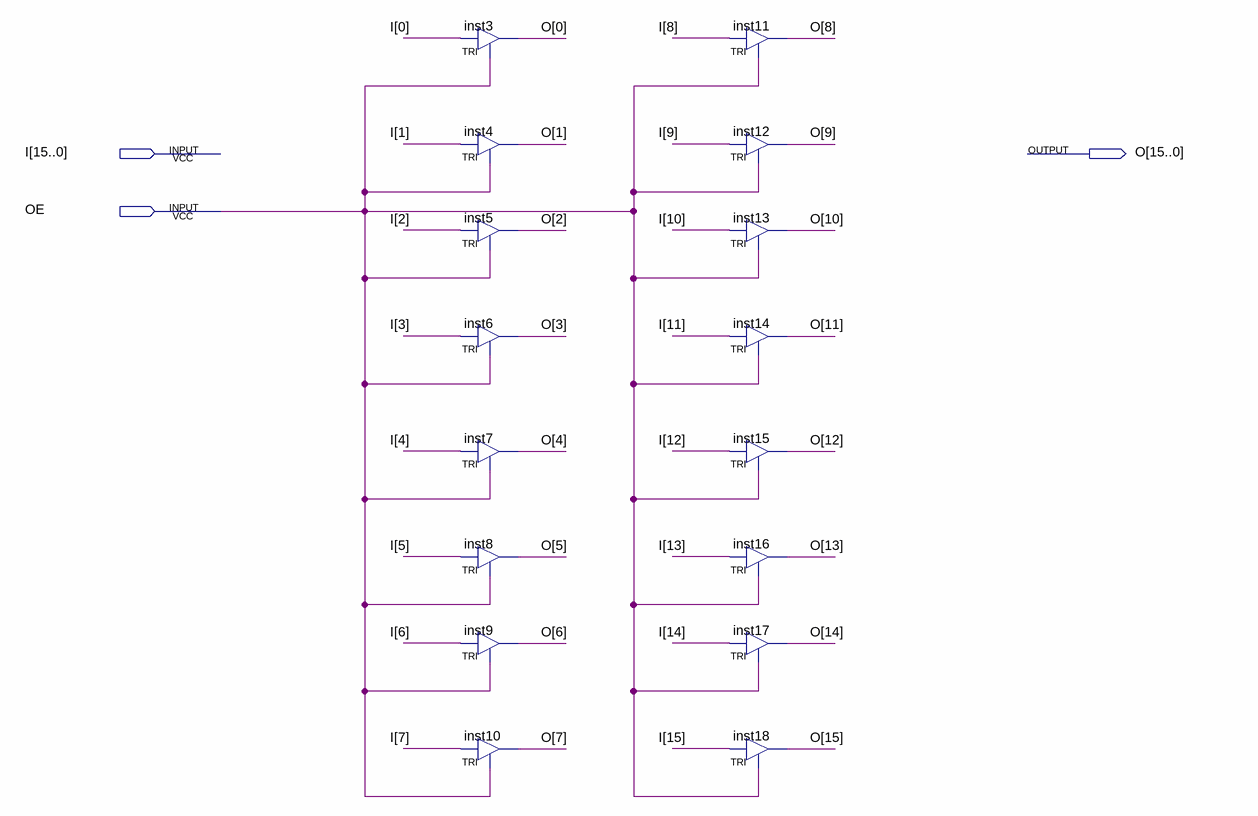
[diagram p0: schematic sheet]
// Quartus schematic tri_16bit.bdf as structural Verilog: 16 symbols, 3 pins
module tri_16bit (
  input  [15:0] I,
  input  OE,
  output [15:0] O
);

  TRI inst3 (.IN(I[0]), .OE(OE), .OUT(O[0]));
  TRI inst4 (.IN(I[1]), .OE(OE), .OUT(O[1]));
  TRI inst5 (.IN(I[2]), .OE(OE), .OUT(O[2]));
  TRI inst6 (.IN(I[3]), .OE(OE), .OUT(O[3]));
  TRI inst7 (.IN(I[4]), .OE(OE), .OUT(O[4]));
  TRI inst8 (.IN(I[5]), .OE(OE), .OUT(O[5]));
  TRI inst9 (.IN(I[6]), .OE(OE), .OUT(O[6]));
  TRI inst10 (.IN(I[7]), .OE(OE), .OUT(O[7]));
  TRI inst11 (.IN(I[8]), .OE(OE), .OUT(O[8]));
  TRI inst12 (.IN(I[9]), .OE(OE), .OUT(O[9]));
  TRI inst13 (.IN(I[10]), .OE(OE), .OUT(O[10]));
  TRI inst14 (.IN(I[11]), .OE(OE), .OUT(O[11]));
  TRI inst15 (.IN(I[12]), .OE(OE), .OUT(O[12]));
  TRI inst16 (.IN(I[13]), .OE(OE), .OUT(O[13]));
  TRI inst17 (.IN(I[14]), .OE(OE), .OUT(O[14]));
  TRI inst18 (.IN(I[15]), .OE(OE), .OUT(O[15]));
endmodule
